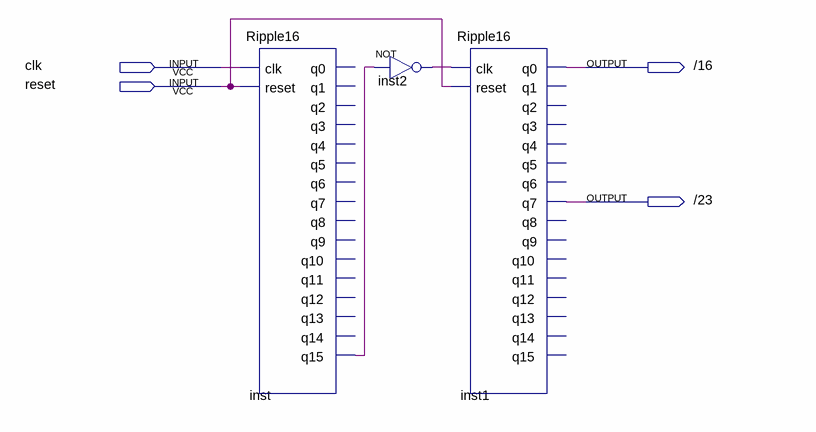
[diagram p0: schematic sheet]
// Quartus schematic ClockDivider.bdf as structural Verilog: 3 symbols, 4 pins
module ClockDivider (
  input  clk,
  input  reset,
  output \/16 ,
  output \/23 
);

  wire inst2_out, inst_q15;

  Ripple16 inst (
    .clk(clk), .reset(reset), .q15(inst_q15));  // open: q0, q1, q2, q3, q4, q5, q6, q7, q8, q9, q10, q11, q12, q13, q14
  not inst2 (inst2_out, inst_q15);
  Ripple16 inst1 (
    .clk(inst2_out), .reset(reset), .q0(\/16 ), .q7(\/23 ));  // open: q1, q2, q3, q4, q5, q6, q8, q9, q10, q11, q12, q13, q14, q15
endmodule
